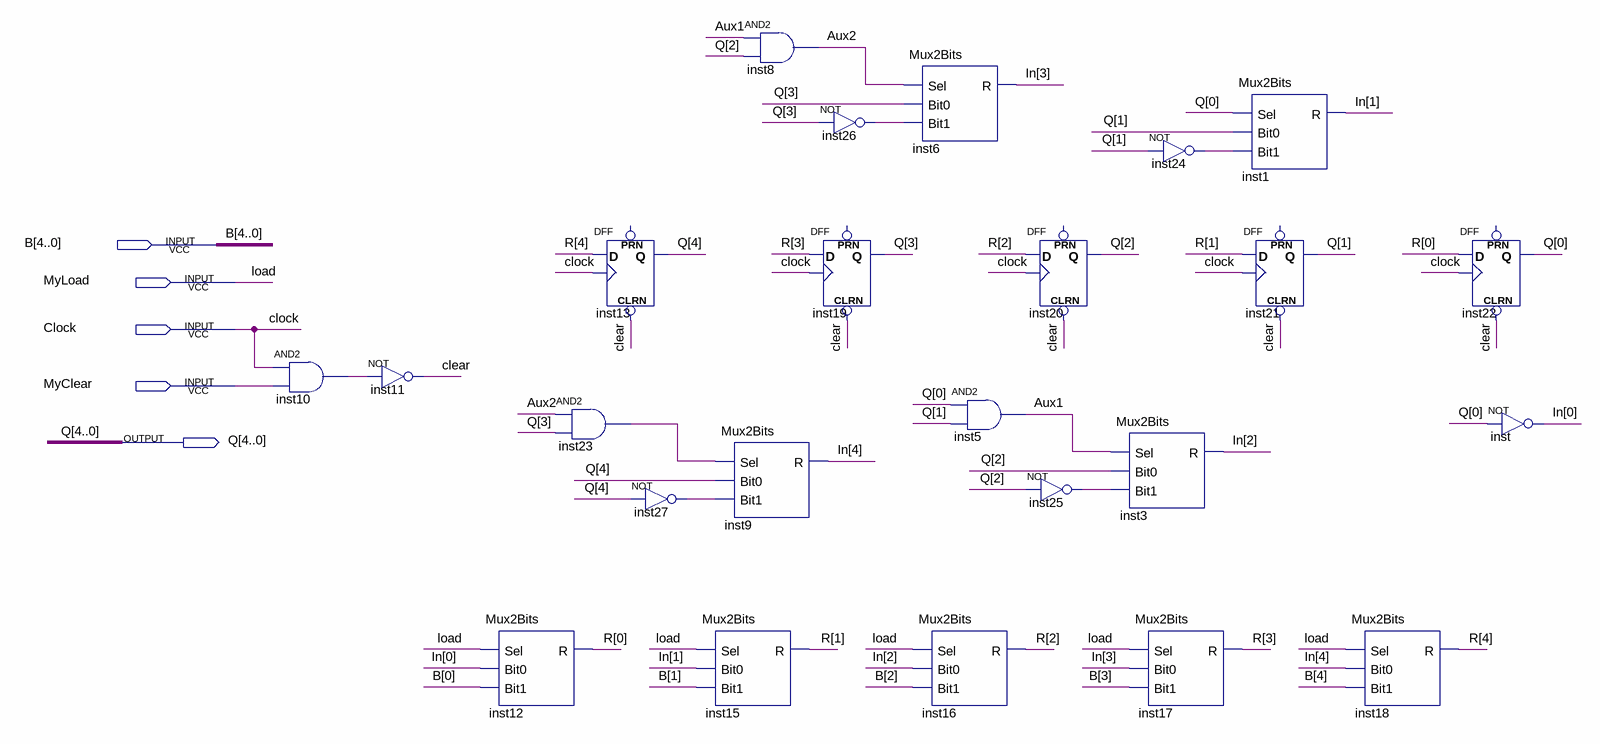
[diagram p0: schematic sheet]
// Quartus schematic SyncCounter.bdf as structural Verilog: 24 symbols, 5 pins
module SyncCounter (
  input  [4:0] B,
  input  MyLoad,
  input  Clock,
  input  MyClear,
  output [4:0] Q
);

  wire Aux1, Aux2, clear, inst10_out, inst23_out, inst24_out, inst25_out, inst26_out, inst27_out;
  wire [4:0] In, R;

  and inst10 (inst10_out, Clock, MyClear);
  not inst11 (clear, inst10_out);
  Mux2Bits inst12 (.Sel(MyLoad), .Bit0(In[0]), .Bit1(B[0]), .R(R[0]));
  DFF inst13 (.CLRN(clear), .CLK(Clock), .D(R[4]), .Q(Q[4]));  // open: PRN
  and inst23 (inst23_out, Aux2, Q[3]);
  not inst27 (inst27_out, Q[4]);
  and inst8 (Aux2, Aux1, Q[2]);
  Mux2Bits inst9 (.Sel(inst23_out), .Bit0(Q[4]), .Bit1(inst27_out), .R(In[4]));
  Mux2Bits inst15 (.Sel(MyLoad), .Bit0(In[1]), .Bit1(B[1]), .R(R[1]));
  not inst26 (inst26_out, Q[3]);
  DFF inst19 (.CLRN(clear), .CLK(Clock), .D(R[3]), .Q(Q[3]));  // open: PRN
  Mux2Bits inst6 (.Sel(Aux2), .Bit0(Q[3]), .Bit1(inst26_out), .R(In[3]));
  and inst5 (Aux1, Q[0], Q[1]);
  Mux2Bits inst16 (.Sel(MyLoad), .Bit0(In[2]), .Bit1(B[2]), .R(R[2]));
  DFF inst20 (.CLRN(clear), .CLK(Clock), .D(R[2]), .Q(Q[2]));  // open: PRN
  not inst25 (inst25_out, Q[2]);
  Mux2Bits inst3 (.Sel(Aux1), .Bit0(Q[2]), .Bit1(inst25_out), .R(In[2]));
  not inst24 (inst24_out, Q[1]);
  Mux2Bits inst17 (.Sel(MyLoad), .Bit0(In[3]), .Bit1(B[3]), .R(R[3]));
  Mux2Bits inst1 (.Sel(Q[0]), .Bit0(Q[1]), .Bit1(inst24_out), .R(In[1]));
  DFF inst21 (.CLRN(clear), .CLK(Clock), .D(R[1]), .Q(Q[1]));  // open: PRN
  Mux2Bits inst18 (.Sel(MyLoad), .Bit0(In[4]), .Bit1(B[4]), .R(R[4]));
  DFF inst22 (.CLRN(clear), .CLK(Clock), .D(R[0]), .Q(Q[0]));  // open: PRN
  not inst (In[0], Q[0]);

  // Other names for the same wires on the sheet: load = MyLoad
endmodule
